# EAGLE schematic LCD_SD Board (EAGLE 6.4)

## Sheet 1 of 2

## Sheet 2 of 2
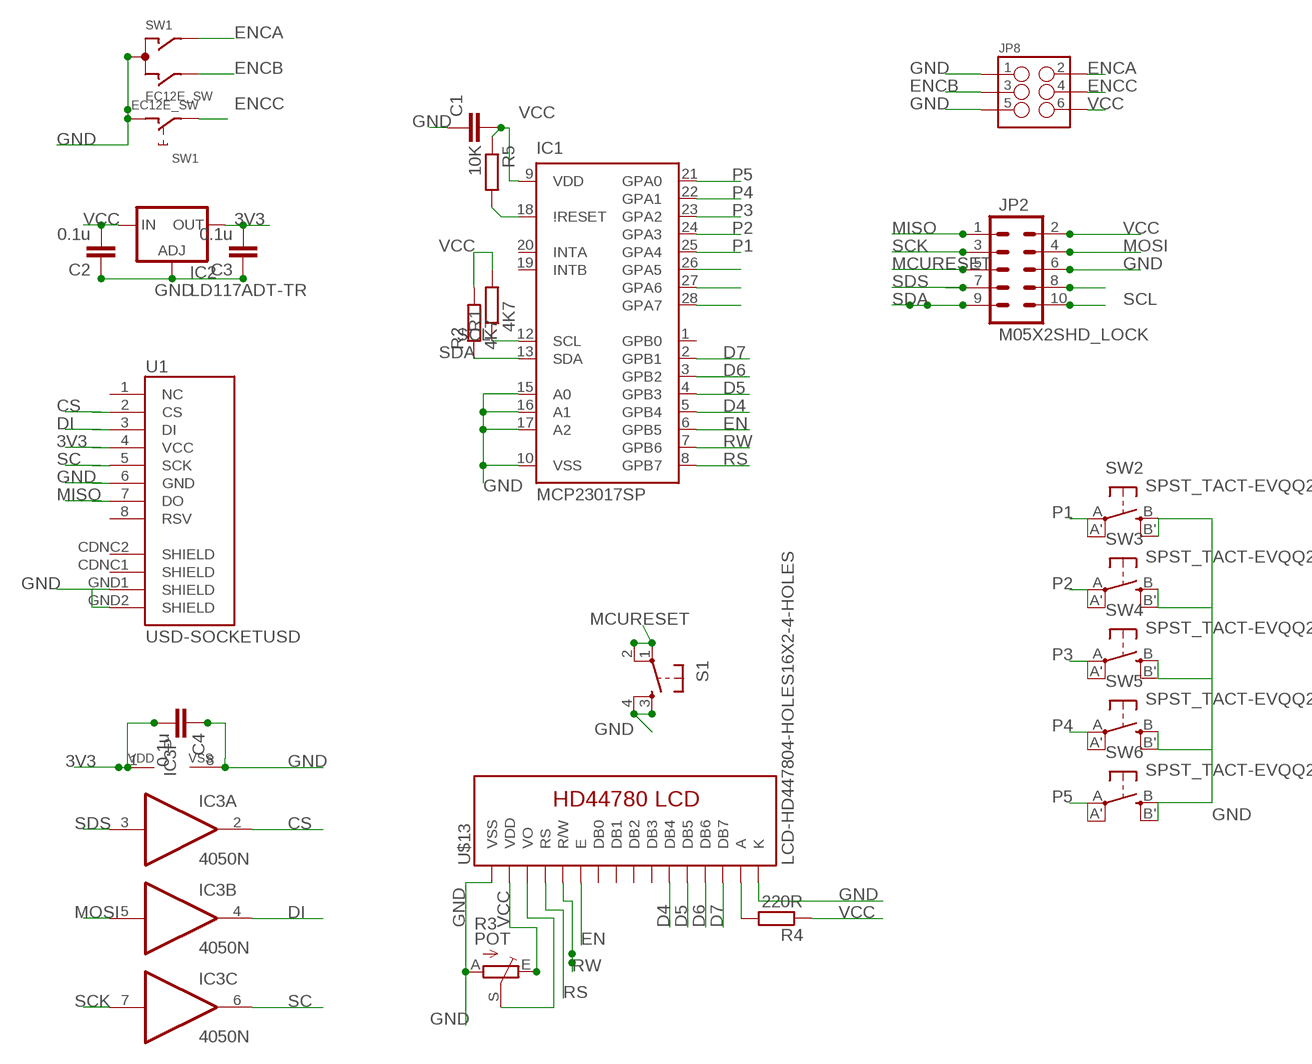
[diagram p0: schematic, sheet 2]

### Parts
C1  CAP1206  [1206]
C2  0.1u  CAP1206  [1206]
C3  0.1u  CAP1206  [1206]
C4  0.1u  CAP1206  [1206]
IC1  MCP23017SP  [DIL28-3]
IC2  LD117ADT-TR  [DPACK]
IC3  4050N  [DIL16]
JP2  M05X2SHD_LOCK  [2X5-SHROUDED_LOCK]
JP8  M03X2SHROUD  [2X3-SHROUDED]
R1  4K7  R-EU_M1206  [M1206]
R2  4K7  R-EU_M1206  [M1206]
R3  POT  TRIM_EU-CA9V  [CA9V]
R4  220R  R-EU_M1206  [M1206]
R5  10K  R-EU_0204/7  [0204/7]
S1  TAC_SWITCHPTH  [TACTILE-PTH]
SW1  EC12E_SW  [ALPS_EC12E_SW]
SW2  SPST_TACT-EVQQ2  [EVQ-Q2]
SW3  SPST_TACT-EVQQ2  [EVQ-Q2]
SW4  SPST_TACT-EVQQ2  [EVQ-Q2]
SW5  SPST_TACT-EVQQ2  [EVQ-Q2]
SW6  SPST_TACT-EVQQ2  [EVQ-Q2]
U1  USD-SOCKETUSD  [USD-SOCKET-PP]
U$13  LCD-HD447804-HOLES16X2-4-HOLES  [LCD-16X2-4HOLES]

### Nets
3V3: C3.2 C4.2 IC2.4(OUT) IC3.1(P:VDD) U1.4(VCC)
CONTRAST: R3.S U$13.3(VO)
CS: IC3.2(A:O) U1.2(CS)
D4: IC1.5(GPB4) U$13.11(DB4)
D5: IC1.4(GPB3) U$13.12(DB5)
D6: IC1.3(GPB2) U$13.13(DB6)
D7: IC1.2(GPB1) U$13.14(DB7)
DI: IC3.4(B:O) U1.3(DI)
EN: IC1.6(GPB5) U$13.6(E)
ENCA: JP8.2 SW1.A
ENCB: JP8.3 SW1.B
ENCC: JP8.4 SW1.E
GND: C1.1 C2.1 C3.1 C4.1 IC1.10(VSS) IC1.15(A0) IC1.16(A1) IC1.17(A2) IC2.1(ADJ) IC3.8(P:VSS) JP2.6 JP8.1 JP8.5 R3.A S1.3 S1.4 SW1.C SW1.D SW2.B'(S1) SW2.B(S) SW3.B'(S1) SW3.B(S) SW4.B'(S1) SW4.B(S) SW5.B'(S1) SW5.B(S) SW6.B'(S1) SW6.B(S) U1.6(GND) U1.GND1(SHIELD) U1.GND2(SHIELD) U$13.1(VSS) U$13.16(K)
MCURESET: JP2.5 S1.1 S1.2
MISO: JP2.1 U1.7(DO)
MOSI: IC3.5(B:I) JP2.4
N$1: IC1.28(GPA7)
N$2: IC1.27(GPA6)
N$3: IC1.26(GPA5)
N$11: R4.2 U$13.15(A)
N$12: IC1.18(\!RESET) R5.2
N$48: JP2.8
P1: IC1.25(GPA4) SW2.A'(P1) SW2.A(P)
P2: IC1.24(GPA3) SW3.A'(P1) SW3.A(P)
P3: IC1.23(GPA2) SW4.A'(P1) SW4.A(P)
P4: IC1.22(GPA1) SW5.A'(P1) SW5.A(P)
P5: IC1.21(GPA0) SW6.A'(P1) SW6.A(P)
RS: IC1.8(GPB7) U$13.4(RS)
RW: IC1.7(GPB6) U$13.5(R/W)
SC: IC3.6(C:O) U1.5(SCK)
SCK: IC3.7(C:I) JP2.3
SCL: IC1.12(SCL) JP2.10 R1.1
SDA: IC1.13(SDA) JP2.9 R2.1
SDS: IC3.3(A:I) JP2.7
VCC: C1.2 C2.2 IC1.9(VDD) IC2.3(IN) JP2.2 JP8.6 R1.2 R2.2 R3.E R4.1 R5.1 U$13.2(VDD)
Unconnected: IC1.1(GPB0) IC1.19(INTB) IC1.20(INTA) IC3.9(D:I) IC3.10(D:O) IC3.11(E:I) IC3.12(E:O) IC3.14(F:I) IC3.15(F:O) SW1.GND1(G) SW1.GND2(G) U1.1(NC) U1.8(RSV) U1.CDNC1(SHIELD) U1.CDNC2(SHIELD) U$13.7(DB0) U$13.8(DB1) U$13.9(DB2) U$13.10(DB3)

## Library data of the parts
C1-C4 = SparkFun-Passives:CAP: Capacitor Standard 0603 ceramic capacitor, and 0.1" leaded capacitor.
IC1 = microchip-update-2:MCP23017: http://ww1.microchip.com/downloads/en/DeviceDoc/21952a.pdf Source: http://ww1.microchip.com/downloads/en/DeviceDoc/21952a.pdf
IC2 = v-reg:LD117A?*: Low drop fixed and adjustable positive voltage regulators 1 A Source: http://www.st.com/stonline/products/literature/ds/7194/ld1117axx.pdf
IC3 = 40xx:4050: Hex non-inverting BUFFER
JP2 = SparkFun-Connectors:M05X2: Header 5x2 Standard 10-pin dual row 0.1" header. Commonly used with AVR-ISP. Use with Spark Fun Electronics SKU: PRT-00778
JP8 = SparkFun-Connectors:M03X2: 2x3 .1" header. Shrouded, with keying- CONN-10681 SMT- CONN-11415 Pogo pins- HW-11044; PROD_ID: CONN-10681
R1 R2 R4 R5 = rcl:R-EU_: RESISTOR, European symbol
R3 = pot:TRIM_EU-: POTENTIOMETER
S1 = SparkFun-Electromechanical:TAC_SWITCH: Momentary Switch Button commonly used for reset or general input. Spark Fun Electronics SKU : COM-00097
SW1 = switch-alps:EC12E_SW: ALPS rotary Encoder EC12E series with switch; MPN: EC12E2424407; OC_FARNELL: 1520813; OC_NEWARK: 74M1068
SW2-SW6 = adafruit:SPST_TACT: SMT 6mm switch, EVQQ2 series http://www.ladyada.net/library/eagle
U1 = SparkFun-Connectors_PETERMICROSDEBAY:USD-SOCKET: microSD Socket Push-push type uSD socket. Schematic element and footprint production proven. Spark Fun Electronics SKU : PRT-00127. tDoc lines correctly indicate media card edge positions when inserting (unlocked, locked, depressed).
U$13 = HD44780LCD:LCD-HD44780